# EAGLE design TL431_Fan_Control (EAGLE 7.6.0)
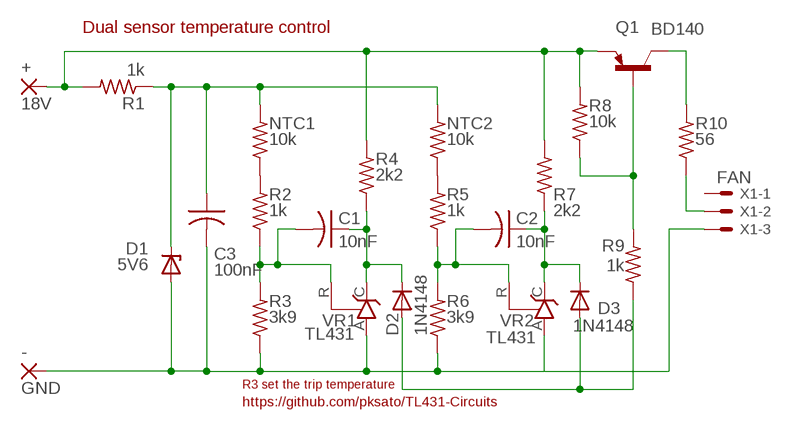
[diagram p0: schematic, sheet 1]

## Parts
+  18V  WIREPAD2,54/1,0  [2,54/1,0]
-  GND  WIREPAD2,54/1,0  [2,54/1,0]
C1  10nF  C-US050-024X044  [C050-024X044]
C2  10nF  C-US050-024X044  [C050-024X044]
C3  100nF  C-US050-024X044  [C050-024X044]
D1  5V6  ZENER-DIODEZD-7.5  [ZDIO-7.5]
D2  1N4148  DIODE-D-5  [D-5]
D3  1N4148  DIODE-D-5  [D-5]
NTC1  10k  R-US_0207/2V  [0207/2V]
NTC2  10k  R-US_0207/2V  [0207/2V]
Q1  BD140  [TO126]
R1  1k  R-US_0207/10  [0207/10]
R2  1k  R-US_0207/10  [0207/10]
R3  3k9  R-US_0207/10  [0207/10]
R4  2k2  R-US_0207/10  [0207/10]
R5  1k  R-US_0207/10  [0207/10]
R6  3k9  R-US_0207/10  [0207/10]
R7  2k2  R-US_0207/10  [0207/10]
R8  10k  R-US_0207/10  [0207/10]
R9  1k  R-US_0207/10  [0207/10]
R10  56  R-US_0617/22  [0617/22]
VR1  TL431  TL431CLP  [TO92-CLP]
VR2  TL431  TL431CLP  [TO92-CLP]
X1  FAN  22-23-2031  [22-23-2031]

## Nets
N$1: C3.1 D1.C NTC1.2 NTC2.2 R1.1
N$2: -.1(P) C3.2 D1.A R3.1 R6.1 VR1.A VR2.A X1.3
N$3: Q1.3(B) R8.1 R9.2
N$4: C1.2 R2.1 R3.2 VR1.R
N$5: C2.2 R5.1 R6.2 VR2.R
N$6: D2.A D3.A R9.1
N$7: +.1(P) Q1.1(E) R1.2 R4.2 R7.2 R8.2
N$8: NTC1.1 R2.2
N$9: NTC2.1 R5.2
N$10: R10.1 X1.2
N$11: Q1.2(C) R10.2
N$12: C2.1 D3.C R7.1 VR2.C
N$13: C1.1 D2.C R4.1 VR1.C
Unconnected: X1.1

## Notes on the sheet
- Dual sensor temperature control
- R3 set the trip temperature
- https://github.com/pksato/TL431-Circuits

## Library data of the parts
+ - = wirepad:WIREPAD: Wire PAD connect wire on PCB
C1-C3 = rcl:C-US: CAPACITOR, American symbol
D1 = diode:ZENER-DIODE: Z-Diode
D2 D3 = diode:DIODE-: DIODE
NTC1 NTC2 R1-R10 = rcl:R-US_: RESISTOR, American symbol
Q1 = transistor-pnp:BD140: PNP Transistor
VR1 VR2 = v-reg:TL431CLP: VOLTAGE REGULATOR
X1 = con-molex:22-23-2031: .100" (2.54mm) Center Header - 3 Pin; MF: MOLEX; MPN: 22-23-2031; OC_FARNELL: 1462950; OC_NEWARK: 30C0862

## Board
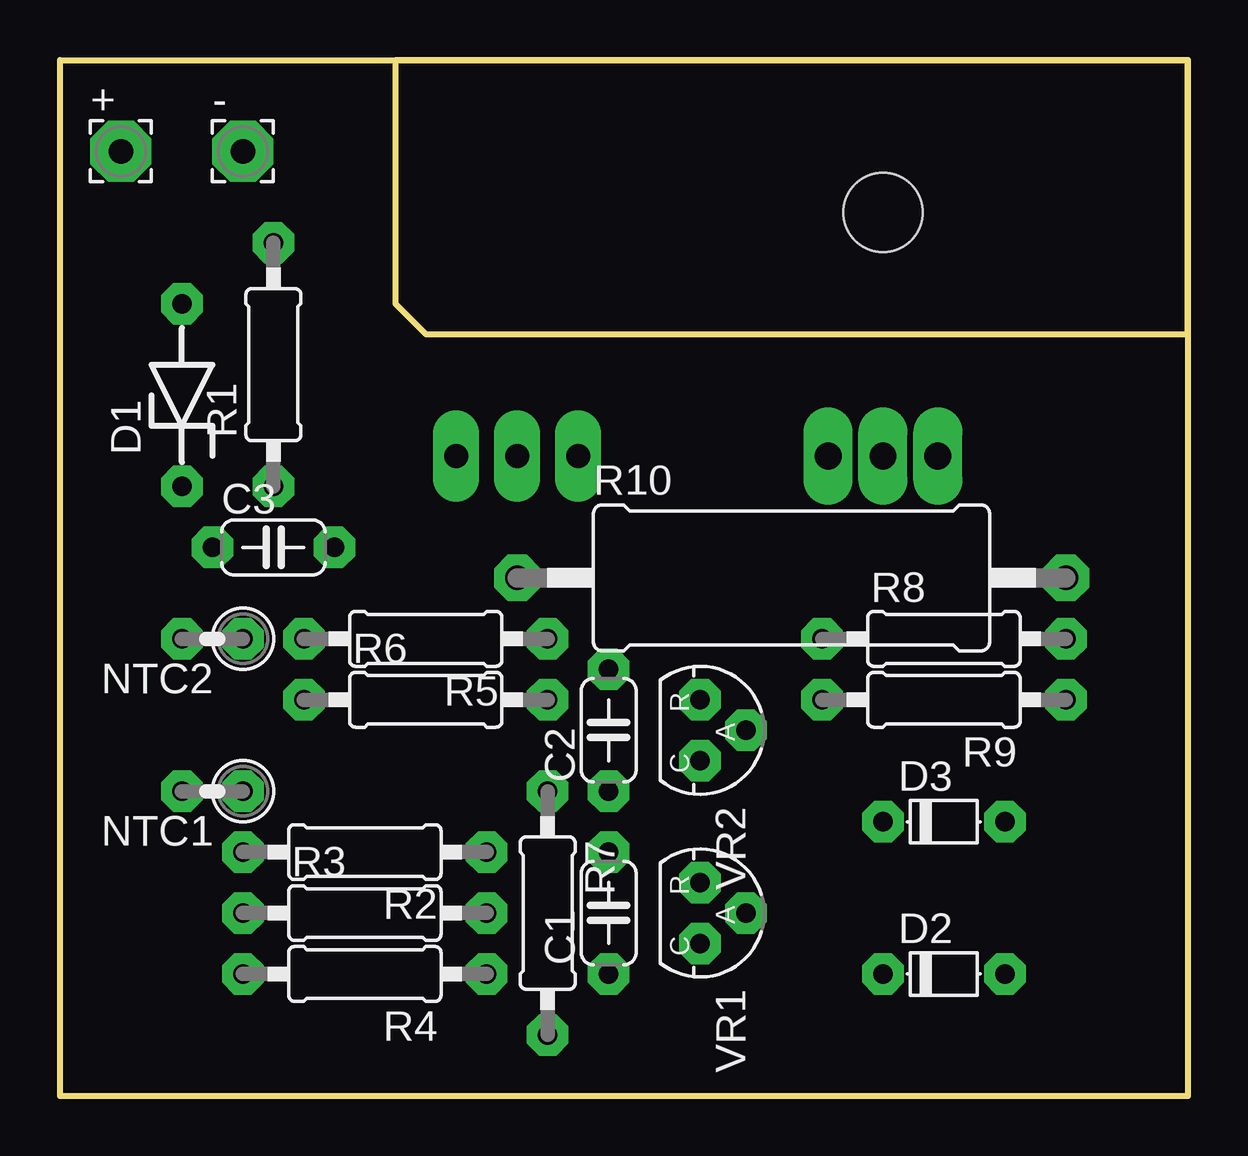
[diagram p1: board, top side]
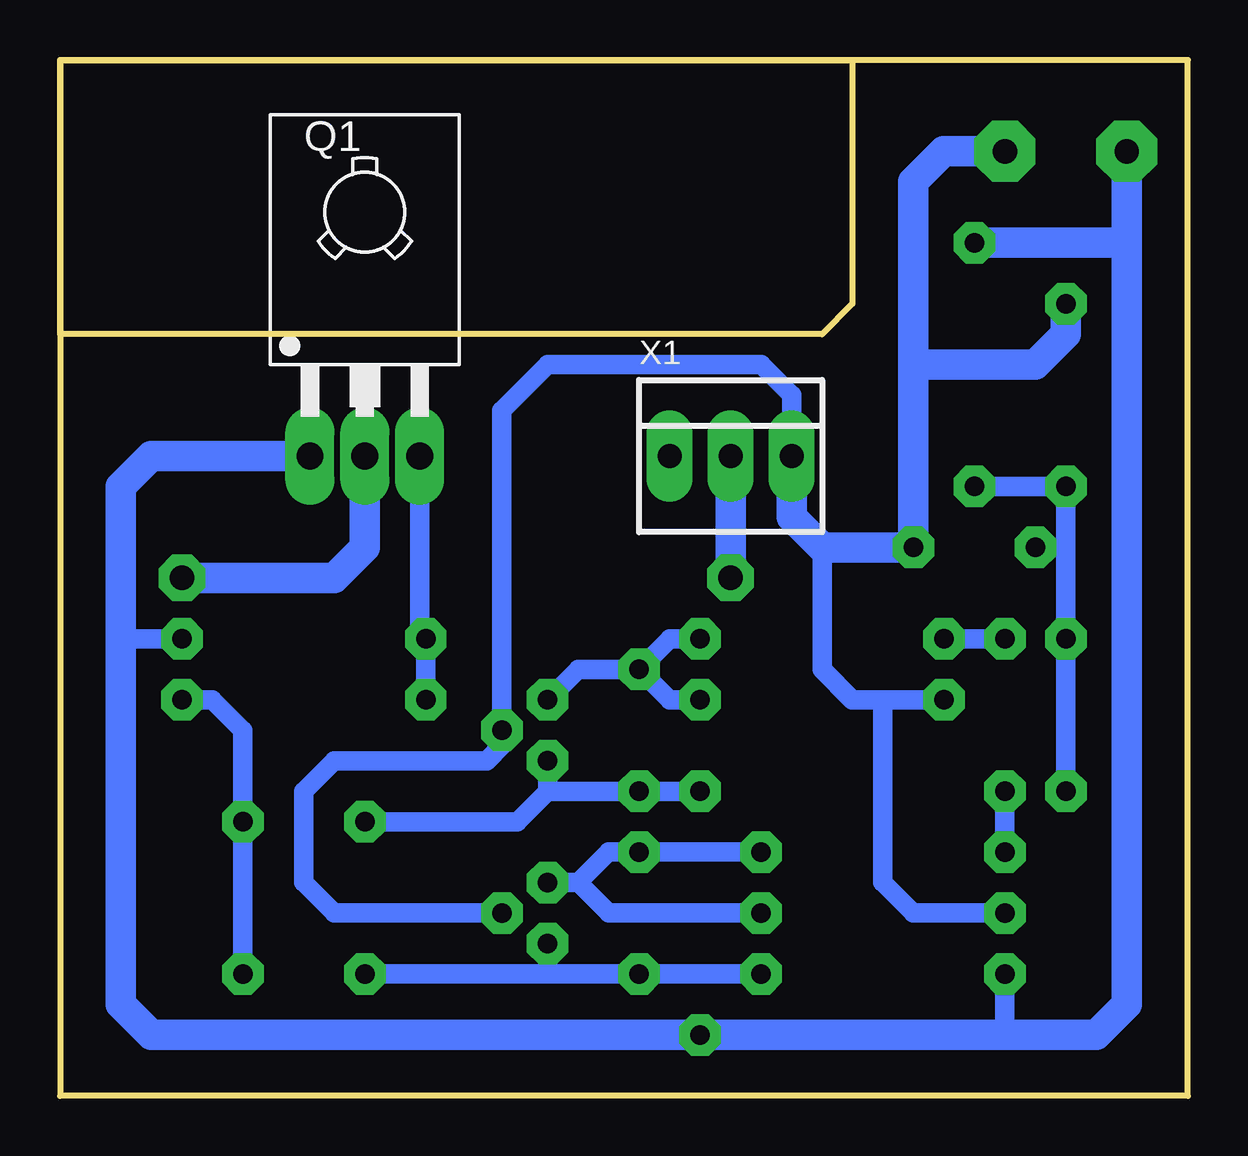
[diagram p2: board, bottom side, seen from below]

Size 46.99 x 43.18 mm. Coordinates in mm from the lower left corner, seen from the top.
Outline: 0,0 46.99,0 46.99,43.18 0,43.18 0,0
Copper layers (1*16): Top 0.035mm / dielectric 1.5mm / Bottom 0.035mm
Design rules "default *": minimum track width 10mil, minimum drill 24mil, track to track 8mil, track to pad 8mil, pad to pad 8mil, via to via 8mil, smd to smd 8mil, copper to edge 40mil, drill to drill 8mil, minimum pad ring 18mil, minimum via ring 8mil, stop-mask expansion 4mil, vias tented up to drill 0mil, thermal gap 10mil

### Footprints (pad centres in the part's own frame; a part is rotated, then mirrored left to right if it is on the bottom)
2,54/1,0 = drill 1.016 pad 2.54 octagon: 1 0,0
C050-024X044 = drill 0.813 octagon: 1 -2.54,0; 2 2.54,0
ZDIO-7.5 = drill 0.813 octagon: A 3.81,0; C -3.81,0
D-5 = drill 0.813 octagon: A 2.54,0; C -2.54,0
0207/2V = drill 0.813 octagon: 1 -1.27,0; 2 1.27,0
TO126 = drill 1.118 long: 1 -2.286,-5.08; 2 0,-5.08; 3 2.286,-5.08 | hole 3.302: 0,5.08
0207/10 = drill 0.813 octagon: 1 -5.08,0; 2 5.08,0
0617/22 = drill 1.016 octagon: 1 -11.43,0; 2 11.43,0
TO92-CLP = drill 0.813 octagon: A 0,1.905; C 1.27,0; R -1.27,0
22-23-2031 = drill 1 long: 1 -2.54,0; 2 0,0; 3 2.54,0

### Placement (x,y rotation side)
+  2.54,39.37 0 top
-  7.62,39.37 0 top
C1  22.86,7.62 90 top
C2  22.86,15.24 90 top
C3  8.89,22.86 0 top
D1  5.08,29.21 90 top
D2  36.83,5.08 0 top
D3  36.83,11.43 0 top
NTC1  6.35,12.7 180 top
NTC2  6.35,19.05 180 top
Q1  34.29,31.75 0 bottom
R1  8.89,30.48 90 top
R2  12.7,10.16 180 top
R3  12.7,7.62 0 top
R4  12.7,5.08 180 top
R5  15.24,19.05 180 top
R6  15.24,16.51 0 top
R7  20.32,7.62 270 top
R8  36.83,19.05 0 top
R9  36.83,16.51 180 top
R10  30.48,21.59 0 top
VR1  26.67,7.62 270 top
VR2  26.67,15.24 270 top
X1  19.05,26.67 0 bottom

### Tracks (layer width: path | path; a pad name or v marks a point on that pad's centre or on a via)
N$1
  Bottom 0.813: 5.08,22.86 D1.C R1.1 | 5.08,22.86 NTC2.2 NTC1.2 | C3.1 5.08,22.86
N$2
  Bottom 0.813: 12.7,16.51 13.97,16.51 15.24,17.78 15.24,22.86 | 12.7,16.51 R6.1 | VR1.A 35.56,7.62 36.83,8.89 36.83,12.7 35.56,13.97 29.21,13.97 28.57,14.61 VR2.A 28.57,28.57 26.67,30.48 17.78,30.48 16.51,29.21 X1.3 | R3.1 11.43,7.62 12.7,8.89 12.7,16.51
  Bottom 1.27: -.1 10.16,39.37 11.43,38.1 11.43,30.48 | 11.43,30.48 C3.2 15.24,22.86 16.51,24.13 X1.3 | 11.43,30.48 6.35,30.48 5.08,31.75 D1.A
N$3
  Bottom 0.813: Q1.3 32,19.3 R8.1 R9.2
N$4
  Bottom 0.813: C1.2 R2.1 24.13,10.16 25.4,8.89 | R3.2 24.13,7.62 25.4,8.89 | 25.4,8.89 VR1.R
N$5
  Bottom 0.813: VR2.R 25.4,17.78 C2.2 | R5.1 21.59,19.05 C2.2 | R6.2 21.59,16.51 C2.2
N$6
  Bottom 0.813: R9.1 40.64,16.51 39.37,15.24 D3.A D2.A
N$7
  Bottom 0.813: R8.2 44.45,19.05 | R4.2 7.62,2.54
  Bottom 1.27: Q1.1 43.18,26.67 44.45,25.4 44.45,19.05 44.45,3.81 43.18,2.54 R7.2 7.62,2.54 3.81,2.54 2.54,3.81 2.54,35.56 | +.1 2.54,35.56 | R1.2 2.54,35.56
N$8
  Bottom 0.813: NTC1.1 R2.2
N$9
  Bottom 0.813: NTC2.1 R5.2
N$10
  Bottom 1.27: X1.2 R10.1
N$11
  Bottom 1.27: Q1.2 34.29,22.86 35.56,21.59 R10.2
N$12
  Bottom 0.813: VR2.C 26.67,12.7 | 26.67,12.7 27.94,11.43 D3.C | 26.67,12.7 C2.1 R7.1
N$13
  Bottom 0.813: 26.67,5.08 C1.1 R4.1 | 26.67,5.08 D2.C | VR1.C 26.67,5.08